# Altium schematic sheet DSP_GPIO_Part2.SchDoc
size A4
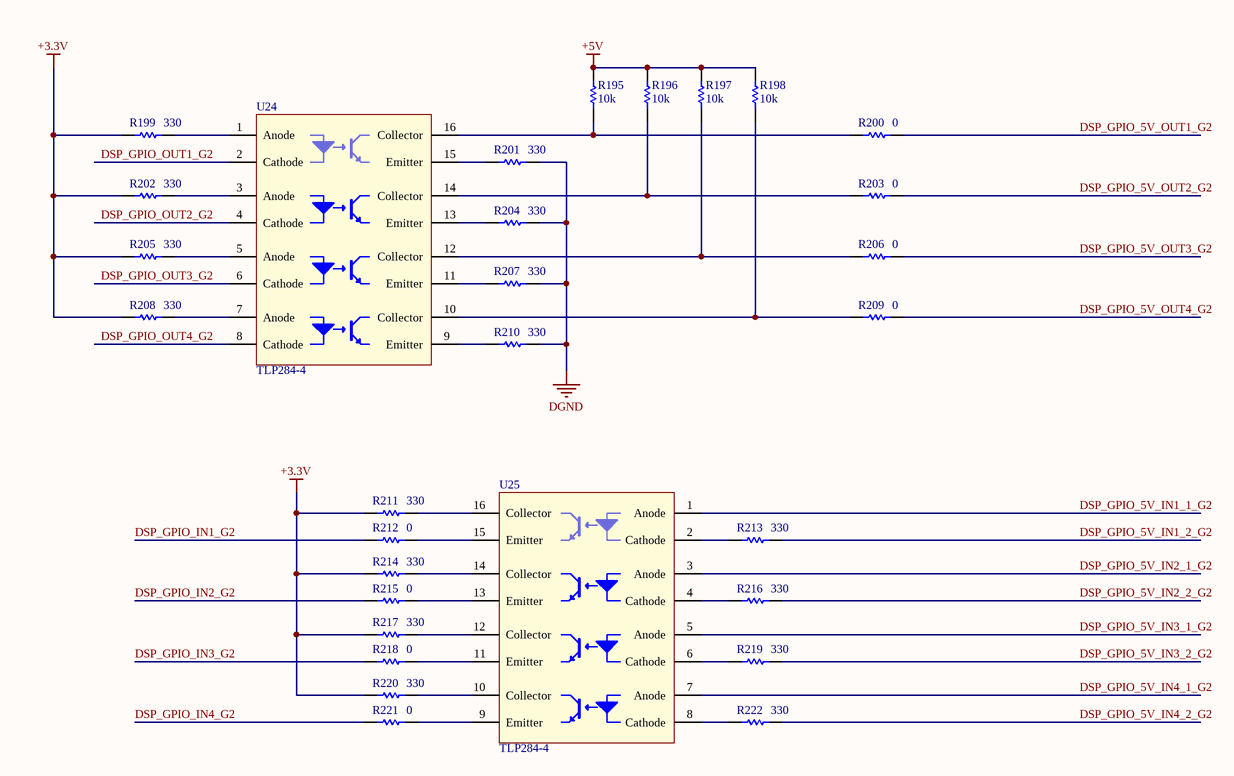
[diagram p0: DSP_GPIO_Part2.SchDoc]

## Parts
R195  value 10k  [1608[0603]]  (hidden comment: Res1)
R196  value 10k  [1608[0603]]  (hidden comment: Res1)
R197  value 10k  [1608[0603]]  (hidden comment: Res1)
R198  value 10k  [1608[0603]]  (hidden comment: Res1)
R199  value 330  [1608[0603]]  (hidden comment: Res1)
R200  value 0  [1608[0603]]  (hidden comment: Res1)
R201  value 330  [1608[0603]]  (hidden comment: Res1)
R202  value 330  [1608[0603]]  (hidden comment: Res1)
R203  value 0  [1608[0603]]  (hidden comment: Res1)
R204  value 330  [1608[0603]]  (hidden comment: Res1)
R205  value 330  [1608[0603]]  (hidden comment: Res1)
R206  value 0  [1608[0603]]  (hidden comment: Res1)
R207  value 330  [1608[0603]]  (hidden comment: Res1)
R208  value 330  [1608[0603]]  (hidden comment: Res1)
R209  value 0  [1608[0603]]  (hidden comment: Res1)
R210  value 330  [1608[0603]]  (hidden comment: Res1)
R211  value 330  [1608[0603]]  (hidden comment: Res1)
R212  value 0  [1608[0603]]  (hidden comment: Res1)
R213  value 330  [1608[0603]]  (hidden comment: Res1)
R214  value 330  [1608[0603]]  (hidden comment: Res1)
R215  value 0  [1608[0603]]  (hidden comment: Res1)
R216  value 330  [1608[0603]]  (hidden comment: Res1)
R217  value 330  [1608[0603]]  (hidden comment: Res1)
R218  value 0  [1608[0603]]  (hidden comment: Res1)
R219  value 330  [1608[0603]]  (hidden comment: Res1)
R220  value 330  [1608[0603]]  (hidden comment: Res1)
R221  value 0  [1608[0603]]  (hidden comment: Res1)
R222  value 330  [1608[0603]]  (hidden comment: Res1)
U24  TLP284-4  [TLP284-4]
U25  TLP284-4  [TLP284-4]

## Nets
+3.3V: R199.1 R202.1 R205.1 R208.1 R211.1 R214.1 R217.1 R220.1
+5V: R195.2 R196.2 R197.2 R198.2
DGND: R201.2 R204.2 R207.2 R210.2
DSP_GPIO_5V_IN1_1_G2: U25.1(Anode)
DSP_GPIO_5V_IN1_2_G2: R213.2
DSP_GPIO_5V_IN2_1_G2: U25.3(Anode)
DSP_GPIO_5V_IN2_2_G2: R216.2
DSP_GPIO_5V_IN3_1_G2: U25.5(Anode)
DSP_GPIO_5V_IN3_2_G2: R219.2
DSP_GPIO_5V_IN4_1_G2: U25.7(Anode)
DSP_GPIO_5V_IN4_2_G2: R222.2
DSP_GPIO_5V_OUT1_G2: R200.2
DSP_GPIO_5V_OUT2_G2: R203.2
DSP_GPIO_5V_OUT3_G2: R206.2
DSP_GPIO_5V_OUT4_G2: R209.2
DSP_GPIO_IN1_G2: R212.1
DSP_GPIO_IN2_G2: R215.1
DSP_GPIO_IN3_G2: R218.1
DSP_GPIO_IN4_G2: R221.1
DSP_GPIO_OUT1_G2: U24.2(Cathode)
DSP_GPIO_OUT2_G2: U24.4(Cathode)
DSP_GPIO_OUT3_G2: U24.6(Cathode)
DSP_GPIO_OUT4_G2: U24.8(Cathode)
NetR195_1: R195.1 R200.1 U24.16(Collector)
NetR196_1: R196.1 R203.1 U24.14(Collector)
NetR197_1: R197.1 R206.1 U24.12(Collector)
NetR198_1: R198.1 R209.1 U24.10(Collector)
NetR199_2: R199.2 U24.1(Anode)
NetR201_1: R201.1 U24.15(Emitter)
NetR202_2: R202.2 U24.3(Anode)
NetR204_1: R204.1 U24.13(Emitter)
NetR205_2: R205.2 U24.5(Anode)
NetR207_1: R207.1 U24.11(Emitter)
NetR208_2: R208.2 U24.7(Anode)
NetR210_1: R210.1 U24.9(Emitter)
NetR211_2: R211.2 U25.16(Collector)
NetR212_2: R212.2 U25.15(Emitter)
NetR213_1: R213.1 U25.2(Cathode)
NetR214_2: R214.2 U25.14(Collector)
NetR215_2: R215.2 U25.13(Emitter)
NetR216_1: R216.1 U25.4(Cathode)
NetR217_2: R217.2 U25.12(Collector)
NetR218_2: R218.2 U25.11(Emitter)
NetR219_1: R219.1 U25.6(Cathode)
NetR220_2: R220.2 U25.10(Collector)
NetR221_2: R221.2 U25.9(Emitter)
NetR222_1: R222.1 U25.8(Cathode)

## Library data of the parts
R195-R222 = Res1: Resistor; Published: 8-Jun-2000; LatestRevisionDate: 17-Jul-2002; LatestRevisionNote: Re-released for DXP Platform.; PackageReference: AXIAL-0.3; Publisher: Altium Limited; PackageDescription: Axial Device, Thru-Hole; 2 Leads; 0.3 in Pin Spacing